# Altium schematic sheet Damper5VLS.SchDoc
size A4; CompanyName: Technische Hochschule Nürnberg Georg Simon Ohm; Address1: Fürther Straße 250; Address2: 90429 Nürnberg; Address3: GERMANY; DocumentNumber: 12; SheetNumber: 12; SheetTotal: 16; CompanyName2: Institut ELSYS
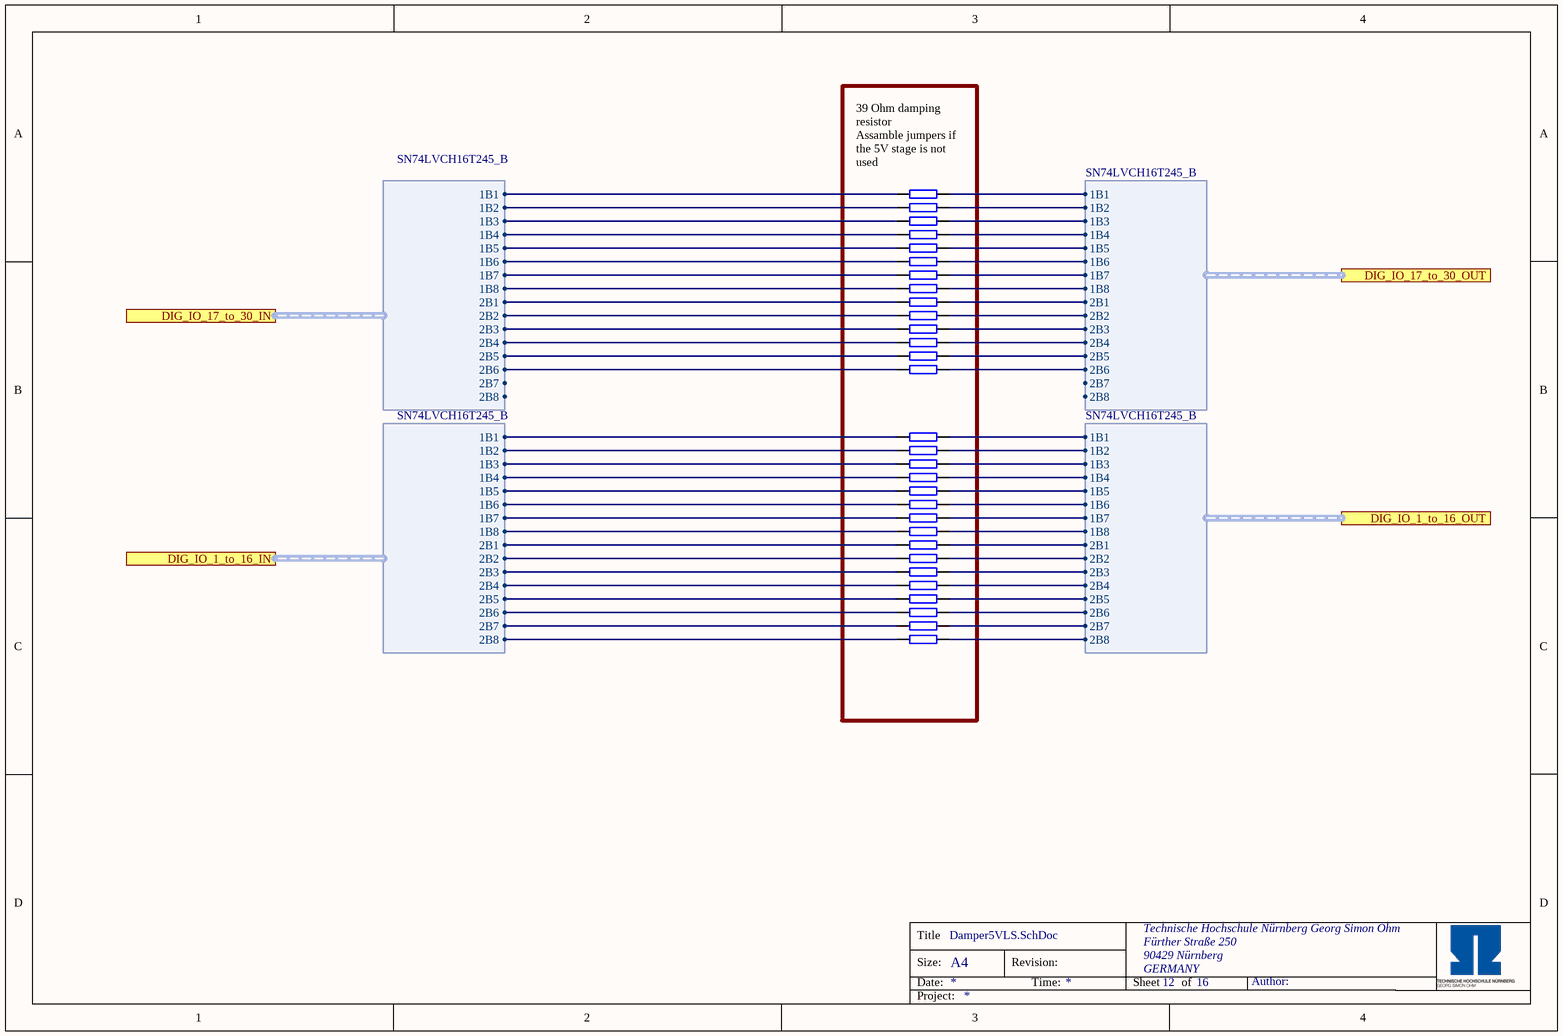
[diagram p0: Damper5VLS.SchDoc]

## Parts
R144  39R  [RES 0603_1608]  (value not drawn)
R145  39R  [RES 0603_1608]  (value not drawn)
R146  39R  [RES 0603_1608]  (value not drawn)
R147  39R  [RES 0603_1608]  (value not drawn)
R148  39R  [RES 0603_1608]  (value not drawn)
R149  39R  [RES 0603_1608]  (value not drawn)
R150  39R  [RES 0603_1608]  (value not drawn)
R151  39R  [RES 0603_1608]  (value not drawn)
R152  39R  [RES 0603_1608]  (value not drawn)
R153  39R  [RES 0603_1608]  (value not drawn)
R154  39R  [RES 0603_1608]  (value not drawn)
R155  39R  [RES 0603_1608]  (value not drawn)
R156  39R  [RES 0603_1608]  (value not drawn)
R157  39R  [RES 0603_1608]  (value not drawn)
R158  39R  [RES 0603_1608]  (value not drawn)
R159  39R  [RES 0603_1608]  (value not drawn)
R160  39R  [RES 0603_1608]  (value not drawn)
R161  39R  [RES 0603_1608]  (value not drawn)
R162  39R  [RES 0603_1608]  (value not drawn)
R163  39R  [RES 0603_1608]  (value not drawn)
R164  39R  [RES 0603_1608]  (value not drawn)
R165  39R  [RES 0603_1608]  (value not drawn)
R166  39R  [RES 0603_1608]  (value not drawn)
R167  39R  [RES 0603_1608]  (value not drawn)
R168  39R  [RES 0603_1608]  (value not drawn)
R169  39R  [RES 0603_1608]  (value not drawn)
R170  39R  [RES 0603_1608]  (value not drawn)
R171  39R  [RES 0603_1608]  (value not drawn)
R172  39R  [RES 0603_1608]  (value not drawn)
R173  39R  [RES 0603_1608]  (value not drawn)

## Ports
DIG_IO_1_to_16_IN (harness SN74LVCH16T245_B), DIG_IO_1_to_16_OUT (harness SN74LVCH16T245_B), DIG_IO_17_to_30_IN (harness SN74LVCH16T245_B), DIG_IO_17_to_30_OUT (harness SN74LVCH16T245_B)

## Harnesses
SN74LVCH16T245_B: 1B1, 1B2, 1B3, 1B4, 1B5, 1B6, 1B7, 1B8, 2B1, 2B2, 2B3, 2B4, 2B5, 2B6, 2B7, 2B8

## Nets
NetR144_1: R144.1 ; port DIG_IO_1_to_16_IN.2B8
NetR144_2: R144.2 ; port DIG_IO_1_to_16_OUT.2B8
NetR145_1: R145.1 ; port DIG_IO_1_to_16_IN.2B7
NetR145_2: R145.2 ; port DIG_IO_1_to_16_OUT.2B7
NetR146_1: R146.1 ; port DIG_IO_1_to_16_IN.2B6
NetR146_2: R146.2 ; port DIG_IO_1_to_16_OUT.2B6
NetR147_1: R147.1 ; port DIG_IO_1_to_16_IN.2B5
NetR147_2: R147.2 ; port DIG_IO_1_to_16_OUT.2B5
NetR148_1: R148.1 ; port DIG_IO_1_to_16_IN.2B4
NetR148_2: R148.2 ; port DIG_IO_1_to_16_OUT.2B4
NetR149_1: R149.1 ; port DIG_IO_1_to_16_IN.2B3
NetR149_2: R149.2 ; port DIG_IO_1_to_16_OUT.2B3
NetR150_1: R150.1 ; port DIG_IO_1_to_16_IN.2B2
NetR150_2: R150.2 ; port DIG_IO_1_to_16_OUT.2B2
NetR151_1: R151.1 ; port DIG_IO_1_to_16_IN.2B1
NetR151_2: R151.2 ; port DIG_IO_1_to_16_OUT.2B1
NetR152_1: R152.1 ; port DIG_IO_1_to_16_IN.1B8
NetR152_2: R152.2 ; port DIG_IO_1_to_16_OUT.1B8
NetR153_1: R153.1 ; port DIG_IO_1_to_16_IN.1B7
NetR153_2: R153.2 ; port DIG_IO_1_to_16_OUT.1B7
NetR154_1: R154.1 ; port DIG_IO_1_to_16_IN.1B6
NetR154_2: R154.2 ; port DIG_IO_1_to_16_OUT.1B6
NetR155_1: R155.1 ; port DIG_IO_1_to_16_IN.1B5
NetR155_2: R155.2 ; port DIG_IO_1_to_16_OUT.1B5
NetR156_1: R156.1 ; port DIG_IO_1_to_16_IN.1B4
NetR156_2: R156.2 ; port DIG_IO_1_to_16_OUT.1B4
NetR157_1: R157.1 ; port DIG_IO_1_to_16_IN.1B3
NetR157_2: R157.2 ; port DIG_IO_1_to_16_OUT.1B3
NetR158_1: R158.1 ; port DIG_IO_1_to_16_IN.1B2
NetR158_2: R158.2 ; port DIG_IO_1_to_16_OUT.1B2
NetR159_1: R159.1 ; port DIG_IO_1_to_16_IN.1B1
NetR159_2: R159.2 ; port DIG_IO_1_to_16_OUT.1B1
NetR160_1: R160.1 ; port DIG_IO_17_to_30_IN.2B6
NetR160_2: R160.2 ; port DIG_IO_17_to_30_OUT.2B6
NetR161_1: R161.1 ; port DIG_IO_17_to_30_IN.2B5
NetR161_2: R161.2 ; port DIG_IO_17_to_30_OUT.2B5
NetR162_1: R162.1 ; port DIG_IO_17_to_30_IN.2B4
NetR162_2: R162.2 ; port DIG_IO_17_to_30_OUT.2B4
NetR163_1: R163.1 ; port DIG_IO_17_to_30_IN.2B3
NetR163_2: R163.2 ; port DIG_IO_17_to_30_OUT.2B3
NetR164_1: R164.1 ; port DIG_IO_17_to_30_IN.2B2
NetR164_2: R164.2 ; port DIG_IO_17_to_30_OUT.2B2
NetR165_1: R165.1 ; port DIG_IO_17_to_30_IN.2B1
NetR165_2: R165.2 ; port DIG_IO_17_to_30_OUT.2B1
NetR166_1: R166.1 ; port DIG_IO_17_to_30_IN.1B8
NetR166_2: R166.2 ; port DIG_IO_17_to_30_OUT.1B8
NetR167_1: R167.1 ; port DIG_IO_17_to_30_IN.1B7
NetR167_2: R167.2 ; port DIG_IO_17_to_30_OUT.1B7
NetR168_1: R168.1 ; port DIG_IO_17_to_30_IN.1B6
NetR168_2: R168.2 ; port DIG_IO_17_to_30_OUT.1B6
NetR169_1: R169.1 ; port DIG_IO_17_to_30_IN.1B5
NetR169_2: R169.2 ; port DIG_IO_17_to_30_OUT.1B5
NetR170_1: R170.1 ; port DIG_IO_17_to_30_IN.1B4
NetR170_2: R170.2 ; port DIG_IO_17_to_30_OUT.1B4
NetR171_1: R171.1 ; port DIG_IO_17_to_30_IN.1B3
NetR171_2: R171.2 ; port DIG_IO_17_to_30_OUT.1B3
NetR172_1: R172.1 ; port DIG_IO_17_to_30_IN.1B2
NetR172_2: R172.2 ; port DIG_IO_17_to_30_OUT.1B2
NetR173_1: R173.1 ; port DIG_IO_17_to_30_IN.1B1
NetR173_2: R173.2 ; port DIG_IO_17_to_30_OUT.1B1

## Notes on the sheet
- 39 Ohm damping resistor
  Assamble jumpers if the 5V stage is not used
- Title
- Size:
- Date:
- A4
- Revision:
- Time:
- Sheet
- of
- Author:
- Project:

## Library data of the parts
R144-R173 = RK73B1JTTDD390J: SMD resistor E24 series; Manufacturer: KOA Speer; Tolerance: 5%; Created from: MGremer; Manufacturer Part Number: RK73B1JTTDD390J; PartID: 40; Created On: 14.12.2020 16:17:14; ComponentLink1Description: Datasheet; ComponentLink1URL: https://www.mouser.de/datasheet/2/219/RK73B-1825463.pdf; Component Type: SMD resistor; Device Package: 0603; Last Updated: 01.03.2021 16:36:36; Mounting Type: SMD; Supplier 1: Mouser; Supplier Part Number 1: 660-RK73B1JTTDD390J; Type: Resistor; Value: 39R; Live Cycle Status: 1; Stock number: Labor SMD Container; LCSC Part Number: C23154